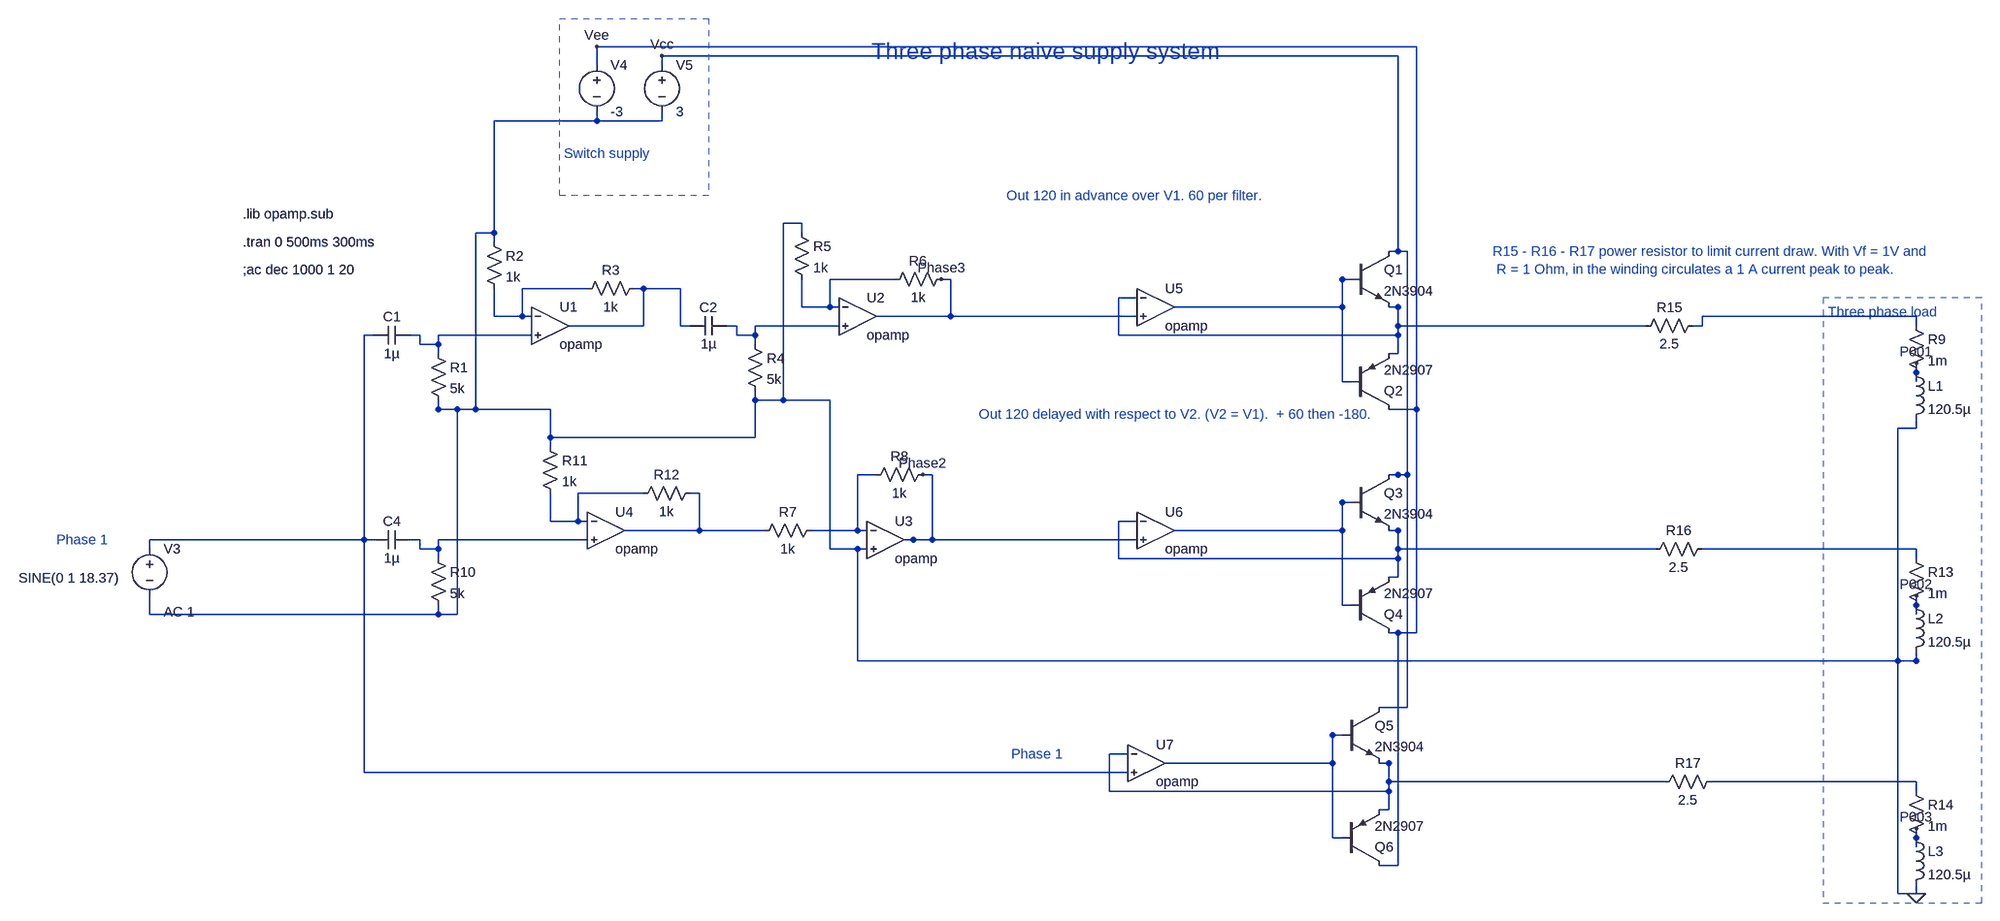
[diagram p0: schematic Three-phase-naive-supply-system.asc]
Three-phase-naive-supply-system.asc, the LTspice schematic file:
Version 4.1
SHEET 1 3352 1016
WIRE 2688 160 2688 176
WIRE 2688 560 2688 576
WIRE 2688 960 2688 976
WIRE 128 128 128 144
WIRE 128 480 128 496
WIRE 320 208 320 192
WIRE 224 -144 224 -160
WIRE 672 112 672 128
WIRE 752 -160 752 -176
WIRE 864 384 848 384
WIRE -368 464 -368 480
WIRE 400 -368 400 -352
WIRE 512 -368 512 -352
WIRE 2688 176 2656 176
WIRE 2656 176 2656 576
WIRE 2656 576 2688 576
WIRE 2688 576 2656 576
WIRE 2656 576 2656 976
WIRE 2656 976 2688 976
WIRE 2688 576 848 576
WIRE 848 576 848 384
WIRE 848 384 800 384
WIRE 800 384 800 128
WIRE 800 128 672 128
WIRE 672 128 720 128
WIRE 720 128 720 -176
WIRE 720 -176 752 -176
WIRE 672 128 672 192
WIRE 672 192 320 192
WIRE 320 192 320 144
WIRE 320 144 128 144
WIRE 128 144 160 144
WIRE 160 144 160 496
WIRE 160 496 128 496
WIRE 128 144 192 144
WIRE 192 144 192 -160
WIRE 192 -160 224 -160
WIRE 224 -160 224 -352
WIRE 224 -352 400 -352
WIRE 400 -352 512 -352
WIRE 128 496 -368 496
WIRE -368 496 -368 480
FLAG 2688 976 0
WIRE 1760 -32 1776 -32
WIRE 1760 48 1776 48
WIRE 2224 0 2208 0
WIRE 1328 -48 1312 -48
WIRE 1776 -32 1776 48
WIRE 1776 -32 1776 0
WIRE 1776 0 2208 0
WIRE 1776 -32 1776 16
WIRE 1776 16 1296 16
WIRE 1296 16 1296 -48
WIRE 1296 -48 1312 -48
WIRE 752 -80 752 -64
WIRE 912 -80 896 -80
WIRE 816 -32 800 -32
WIRE 752 -64 752 -32
WIRE 752 -32 800 -32
WIRE 800 -32 800 -80
WIRE 800 -80 896 -80
WIRE 1696 -80 1680 -80
WIRE 1696 96 1680 96
WIRE 1392 -32 1408 -32
WIRE 1680 -80 1680 96
WIRE 1680 -80 1680 -32
WIRE 1680 -32 1408 -32
WIRE 224 -64 224 -48
WIRE 384 -64 368 -64
WIRE 288 -16 272 -16
WIRE 224 -48 224 -16
WIRE 224 -16 272 -16
WIRE 272 -16 272 -64
WIRE 272 -64 368 -64
WIRE 560 0 544 0
WIRE 464 -64 480 -64
WIRE 352 0 368 0
WIRE 544 0 544 -64
WIRE 544 -64 480 -64
WIRE 480 -64 480 0
WIRE 480 0 368 0
WIRE 624 0 640 0
WIRE 672 32 672 16
WIRE 816 0 800 0
WIRE 640 0 640 16
WIRE 640 16 672 16
WIRE 672 16 672 0
WIRE 672 0 800 0
WIRE 2304 0 2320 0
WIRE 2688 0 2688 -16
WIRE 2320 0 2320 -16
WIRE 2320 -16 2688 -16
WIRE 16 16 0 16
WIRE 16 368 0 368
WIRE 1312 768 1296 768
WIRE -368 384 -368 368
WIRE 0 16 0 368
WIRE 0 368 -368 368
WIRE 0 368 0 768
WIRE 0 768 1296 768
WIRE 80 16 96 16
WIRE 128 48 128 32
WIRE 288 16 272 16
WIRE 96 16 96 32
WIRE 96 32 128 32
WIRE 128 32 128 16
WIRE 128 16 272 16
WIRE 1760 352 1776 352
WIRE 1760 432 1776 432
WIRE 2240 384 2224 384
WIRE 1328 336 1312 336
WIRE 1776 352 1776 432
WIRE 1776 352 1776 400
WIRE 1776 400 1296 400
WIRE 1296 400 1296 336
WIRE 1296 336 1312 336
WIRE 1776 352 1776 384
WIRE 1776 384 2224 384
WIRE 768 352 784 352
WIRE 880 256 864 256
WIRE 864 352 848 352
WIRE 784 352 848 352
WIRE 848 352 848 256
WIRE 848 256 864 256
WIRE 320 288 320 304
WIRE 480 288 464 288
WIRE 384 336 368 336
WIRE 320 304 320 336
WIRE 320 336 368 336
WIRE 368 336 368 288
WIRE 368 288 464 288
WIRE 560 288 576 288
WIRE 688 352 672 352
WIRE 448 352 464 352
WIRE 576 288 576 352
WIRE 576 352 672 352
WIRE 576 352 464 352
WIRE 1696 304 1680 304
WIRE 1696 480 1680 480
WIRE 1392 352 1408 352
WIRE 1680 304 1680 480
WIRE 1680 304 1680 352
WIRE 1680 352 1408 352
WIRE 80 368 96 368
WIRE 128 400 128 384
WIRE 384 368 368 368
WIRE 96 368 96 384
WIRE 96 384 128 384
WIRE 128 384 128 368
WIRE 128 368 368 368
WIRE 2688 400 2688 384
WIRE 2320 384 2336 384
WIRE 2688 384 2336 384
WIRE 1744 752 1760 752
WIRE 1744 832 1760 832
WIRE 2256 784 2240 784
WIRE 1312 736 1296 736
WIRE 1760 752 1760 832
WIRE 1760 752 1760 800
WIRE 1760 800 1280 800
WIRE 1280 800 1280 736
WIRE 1280 736 1296 736
WIRE 1760 752 1760 784
WIRE 1760 784 2240 784
WIRE 1680 704 1664 704
WIRE 1680 880 1664 880
WIRE 1376 752 1392 752
WIRE 1664 704 1664 880
WIRE 1664 704 1664 752
WIRE 1664 752 1392 752
WIRE 2688 800 2688 784
WIRE 2336 784 2352 784
WIRE 2688 784 2352 784
WIRE 2688 80 2688 64
WIRE 2688 80 2688 96
FLAG 2688 64 P001
WIRE 2688 480 2688 464
WIRE 2688 480 2688 496
FLAG 2688 464 P002
WIRE 2688 880 2688 864
WIRE 2688 880 2688 896
FLAG 2688 864 P003
WIRE 960 256 976 256
WIRE 928 368 944 368
WIRE 1328 368 1312 368
WIRE 976 256 976 368
WIRE 976 368 944 368
WIRE 944 368 1312 368
FLAG 960 256 Phase2
WIRE 992 -80 1008 -80
WIRE 880 -16 896 -16
WIRE 1328 -16 1312 -16
WIRE 1008 -80 1008 -16
WIRE 1008 -16 896 -16
WIRE 1008 -16 1312 -16
FLAG 992 -80 Phase3
WIRE 1760 -128 1776 -128
WIRE 1760 256 1776 256
WIRE 1744 656 1760 656
WIRE 512 -448 512 -464
WIRE 1776 -128 1792 -128
WIRE 1792 -128 1792 256
WIRE 1792 256 1776 256
WIRE 1776 256 1792 256
WIRE 1792 256 1792 656
WIRE 1792 656 1760 656
WIRE 1776 -128 1776 -464
WIRE 1776 -464 512 -464
FLAG 512 -464 Vcc
WIRE 1760 144 1776 144
WIRE 1760 528 1776 528
WIRE 1744 928 1760 928
WIRE 400 -448 400 -464
WIRE 1776 144 1808 144
WIRE 1808 144 1808 528
WIRE 1808 528 1776 528
WIRE 1776 528 1776 928
WIRE 1776 928 1760 928
WIRE 1808 144 1808 -480
WIRE 1808 -480 400 -480
WIRE 400 -480 400 -464
FLAG 400 -480 Vee
SYMBOL cap 80 0 R90
WINDOW 0 0 32 VBottom 2
WINDOW 3 32 32 VTop 2
SYMATTR InstName C1
SYMATTR Value 1µ
SYMBOL res 112 32 R0
SYMATTR InstName R1
SYMATTR Value 5k
SYMBOL Opamps\\opamp 320 -64 R0
SYMATTR InstName U1
SYMBOL res 208 -160 R0
SYMATTR InstName R2
SYMATTR Value 1k
SYMBOL res 480 -80 R90
WINDOW 0 0 56 VBottom 2
WINDOW 3 32 56 VTop 2
SYMATTR InstName R3
SYMATTR Value 1k
SYMBOL cap 624 -16 R90
WINDOW 0 0 32 VBottom 2
WINDOW 3 32 32 VTop 2
SYMATTR InstName C2
SYMATTR Value 1µ
SYMBOL res 656 16 R0
SYMATTR InstName R4
SYMATTR Value 5k
SYMBOL Opamps\\opamp 848 -80 R0
SYMATTR InstName U2
SYMBOL res 736 -176 R0
SYMATTR InstName R5
SYMATTR Value 1k
SYMBOL res 1008 -96 R90
WINDOW 0 0 56 VBottom 2
WINDOW 3 32 56 VTop 2
SYMATTR InstName R6
SYMATTR Value 1k
SYMBOL Opamps\\opamp 896 304 R0
SYMATTR InstName U3
SYMBOL cap 80 352 R90
WINDOW 0 0 32 VBottom 2
WINDOW 3 32 32 VTop 2
SYMATTR InstName C4
SYMATTR Value 1µ
SYMBOL res 112 384 R0
SYMATTR InstName R10
SYMATTR Value 5k
SYMBOL Opamps\\opamp 416 288 R0
SYMATTR InstName U4
SYMBOL res 304 192 R0
SYMATTR InstName R11
SYMATTR Value 1k
SYMBOL res 576 272 R90
WINDOW 0 0 56 VBottom 2
WINDOW 3 32 56 VTop 2
SYMATTR InstName R12
SYMATTR Value 1k
SYMBOL res 784 336 R90
WINDOW 0 0 56 VBottom 2
WINDOW 3 32 56 VTop 2
SYMATTR InstName R7
SYMATTR Value 1k
SYMBOL res 976 240 R90
WINDOW 0 0 56 VBottom 2
WINDOW 3 32 56 VTop 2
SYMATTR InstName R8
SYMATTR Value 1k
SYMBOL res 2672 -16 R0
SYMATTR InstName R9
SYMATTR Value 1m
SYMBOL ind 2672 64 R0
SYMATTR InstName L1
SYMATTR Value 120.5µ
SYMBOL res 2672 384 R0
SYMATTR InstName R13
SYMATTR Value 1m
SYMBOL ind 2672 464 R0
SYMATTR InstName L2
SYMATTR Value 120.5µ
SYMBOL voltage -368 368 R0
WINDOW 3 -225 66 Left 2
WINDOW 123 24 124 Left 2
WINDOW 39 0 0 Left 2
SYMATTR Value SINE(0 1 18.37)
SYMATTR Value2 AC 1
SYMATTR InstName V3
SYMBOL res 2672 784 R0
SYMATTR InstName R14
SYMATTR Value 1m
SYMBOL ind 2672 864 R0
SYMATTR InstName L3
SYMATTR Value 120.5µ
SYMBOL res 2208 16 R270
WINDOW 0 32 56 VTop 2
WINDOW 3 0 56 VBottom 2
SYMATTR InstName R15
SYMATTR Value 2.5
SYMBOL res 2224 400 R270
WINDOW 0 32 56 VTop 2
WINDOW 3 0 56 VBottom 2
SYMATTR InstName R16
SYMATTR Value 2.5
SYMBOL res 2240 800 R270
WINDOW 0 32 56 VTop 2
WINDOW 3 0 56 VBottom 2
SYMATTR InstName R17
SYMATTR Value 2.5
SYMBOL voltage 512 -464 R0
WINDOW 123 0 0 Left 2
WINDOW 39 0 0 Left 2
SYMATTR InstName V5
SYMATTR Value 3
SYMBOL npn 1696 -128 R0
SYMATTR InstName Q1
SYMATTR Value 2N3904
SYMBOL Opamps\\opamp 1360 -96 R0
SYMATTR InstName U5
SYMBOL voltage 400 -464 R0
WINDOW 123 0 0 Left 2
WINDOW 39 0 0 Left 2
SYMATTR InstName V4
SYMATTR Value -3
SYMBOL pnp 1696 144 M180
SYMATTR InstName Q2
SYMATTR Value 2N2907
SYMBOL npn 1696 256 R0
SYMATTR InstName Q3
SYMATTR Value 2N3904
SYMBOL Opamps\\opamp 1360 288 R0
SYMATTR InstName U6
SYMBOL pnp 1696 528 M180
SYMATTR InstName Q4
SYMATTR Value 2N2907
SYMBOL npn 1680 656 R0
SYMATTR InstName Q5
SYMATTR Value 2N3904
SYMBOL Opamps\\opamp 1344 688 R0
SYMATTR InstName U7
SYMBOL pnp 1680 928 M180
SYMATTR InstName Q6
SYMATTR Value 2N2907
TEXT -208 -96 Left 2 !;ac dec 1000 1 20
TEXT -208 -192 Left 2 !.lib opamp.sub
TEXT -208 -144 Left 2 !.tran 0 500ms 300ms
TEXT 1104 -224 Left 2 ;Out 120 in advance over V1. 60 per filter.
TEXT 1056 152 Left 2 ;Out 120 delayed with respect to V2. (V2 = V1).  + 60 then -180.
TEXT 872 -472 Left 4 ;Three phase naive supply system
TEXT -528 368 Left 2 ;Phase 1
TEXT 1112 736 Left 2 ;Phase 1
TEXT 1960 -128 Left 2 ;R15 - R16 - R17 power resistor to limit current draw. With Vf = 1V and\n R = 1 Ohm, in the winding circulates a 1 A current peak to peak.
TEXT 344 -296 Left 2 ;Switch supply
TEXT 2536 -24 Left 2 ;Three phase load
RECTANGLE Normal 2528 992 2800 -48 2
RECTANGLE Normal 592 -224 336 -528 2

The netlist it stands for:
* Three-phase-naive-supply-system.asc
C1 N009 N008 1µ
R1 N009 0 5k
X§U1 N004 N009 N005 opamp Aol=100K GBW=10Meg  ; pins invin noninvin out
R2 0 N004 1k
R3 N005 N004 1k
C2 N006 N005 1µ
R4 N006 0 5k
X§U2 N002 N006 Phase3 opamp Aol=100K GBW=10Meg  ; pins invin noninvin out
R5 0 N002 1k
R6 Phase3 N002 1k
X§U3 N011 0 Phase2 opamp Aol=100K GBW=10Meg  ; pins invin noninvin out
C4 N015 N008 1µ
R10 N015 0 5k
X§U4 N012 N015 N013 opamp Aol=100K GBW=10Meg  ; pins invin noninvin out
R11 0 N012 1k
R12 N013 N012 1k
R7 N011 N013 1k
R8 Phase2 N011 1k
R9 N007 P001 1m
L1 P001 0 120.5µ
R13 N016 P002 1m
L2 P002 0 120.5µ
V3 N008 0 SINE(0 1 18.37) AC 1
R14 N019 P003 1m
L3 P003 0 120.5µ
R15 N001 N007 2.5
R16 N010 N016 2.5
R17 N017 N019 2.5
V5 Vcc 0 3
Q1 Vcc N003 N001 0 2N3904
X§U5 N001 Phase3 N003 opamp Aol=100K GBW=10Meg  ; pins invin noninvin out
V4 Vee 0 -3
Q2 Vee N003 N001 0 2N2907
Q3 Vcc N014 N010 0 2N3904
X§U6 N010 Phase2 N014 opamp Aol=100K GBW=10Meg  ; pins invin noninvin out
Q4 Vee N014 N010 0 2N2907
Q5 Vcc N018 N017 0 2N3904
X§U7 N017 N008 N018 opamp Aol=100K GBW=10Meg  ; pins invin noninvin out
Q6 Vee N018 N017 0 2N2907
.model NPN NPN
.model PNP PNP
.lib standard.bjt
;ac dec 1000 1 20
.lib opamp.sub
.tran 0 500ms 300ms
* Out 120 in advance over V1. 60 per filter.
* Out 120 delayed with respect to V2. (V2 = V1).  + 60 then -180.
* Three phase naive supply system
* Phase 1
* Phase 1
* R15 - R16 - R17 power resistor to limit current draw. With Vf = 1V and
*  R = 1 Ohm, in the winding circulates a 1 A current peak to peak.
* Switch supply
* Three phase load
.backanno
.end